# Altium schematic sheet Sheet1.SchDoc
size A4
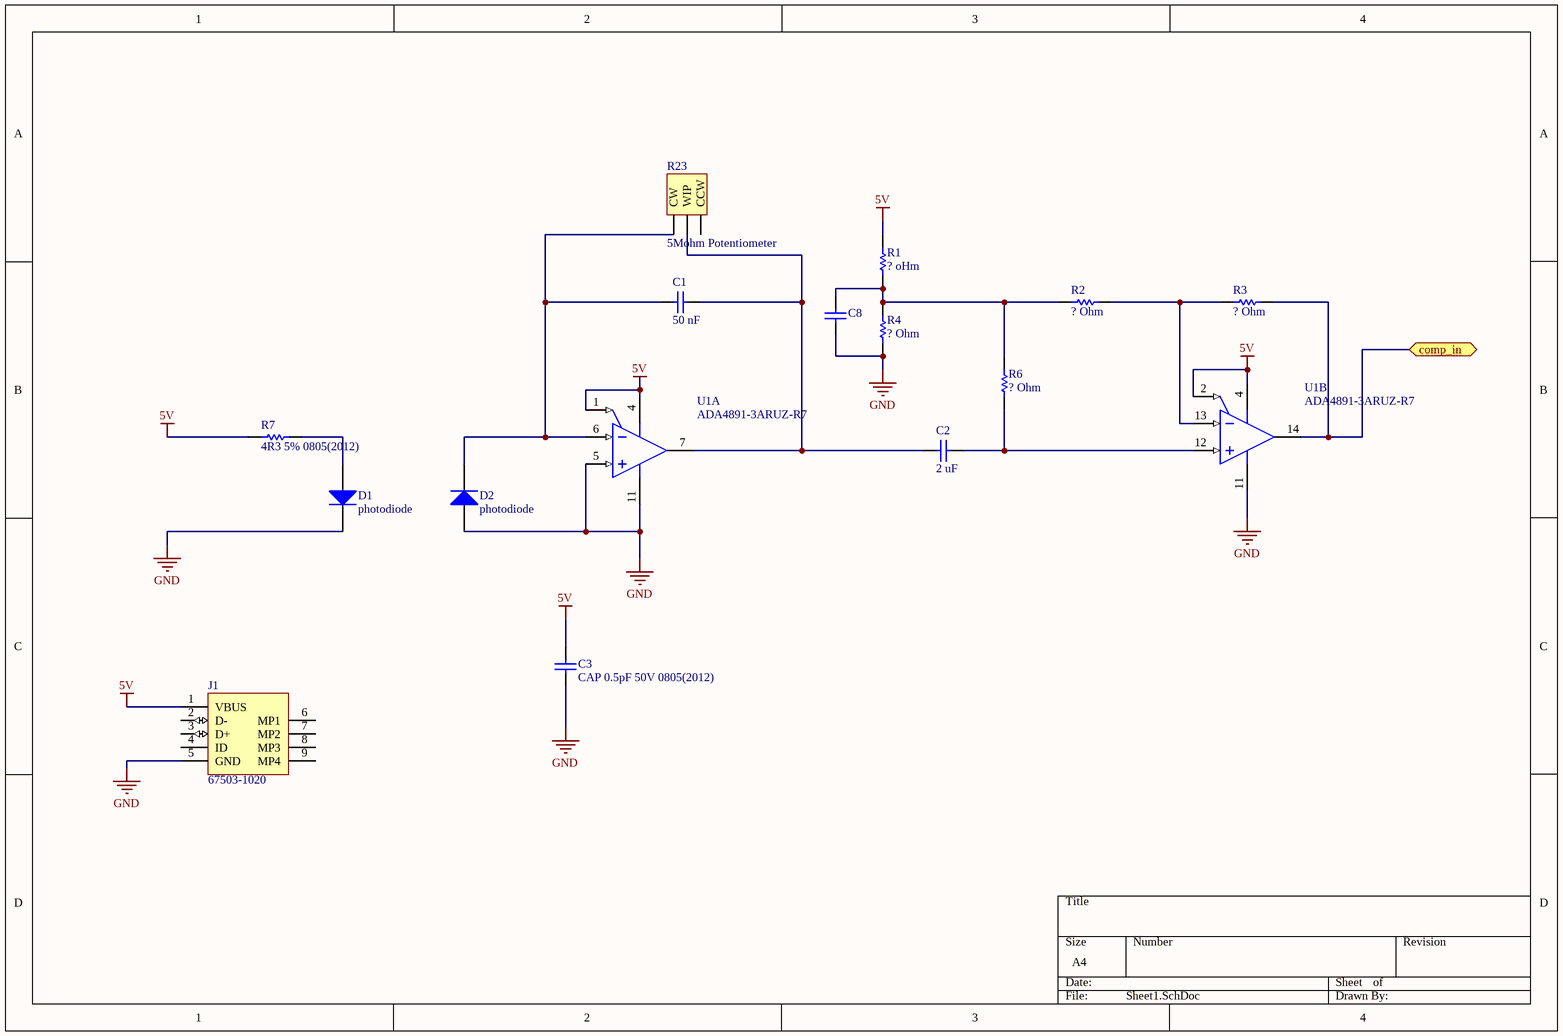
[diagram p0: Sheet1.SchDoc]

## Parts
C1  50 nF  [CAPC0805(2012)75_M]
C2  2 uF  [CAPC0805(2012)75_M]
C3  CAP 0.5pF 50V 0805(2012)  [CAPC0805(2012)75_M]
C8  CAP 0.5pF 50V 0805(2012)  [CAPC0805(2012)75_M]  (value not drawn)
D1  photodiode  [3mm_diode]
D2  photodiode  [3mm_diode]
J1  67503-1020  [MOLX-67503-1020_V]
R1  ? oHm  [RESC0805(2012)_M]
R2  ? Ohm  [RESC0805(2012)_M]
R3  ? Ohm  [RESC0805(2012)_M]
R4  ? Ohm  [RESC0805(2012)_M]
R6  ? Ohm  [RESC0805(2012)_M]
R7  4R3 5% 0805(2012)  [RESC0805(2012)_M]
R23  5Mohm Potentiometer  [5k_pot]
U1  ADA4891-3ARUZ-R7  [ADI-RU-14_L]  (parts A,B of 3)

## Ports
comp_in

## Nets
5V: C3.2 J1.1(VBUS) R1.2 R7.2 U1.1(~{PD1}) U1.2(~{PD2}) U1.4(+VS)
GND: C3.1 C8.1 D1.2(K) D2.1(A) J1.5(GND) R4.1 U1.5(+IN_1) U1.11(-VS)
comp_in: R3.2 U1.14(OUT_2) ; port comp_in
NetC1_1: C1.1 C2.2 R23.2(WIP) U1.7(OUT_1)
NetC1_2: C1.2 D2.2(K) R23.1(CW) U1.6(-IN_1)
NetC2_1: C2.1 R6.1 U1.12(+IN_2)
NetC8_2: C8.2 R1.1 R2.1 R4.2 R6.2
NetD1_1: D1.1(A) R7.1
NetR2_2: R2.2 R3.1 U1.13(-IN_2)

Not connected (* = marked no-connect by the designer): J1 2(D-) 3(D+) 4(ID) 6(MP1) 7(MP2) 8(MP3) 9(MP4); R23 3(CCW)

## Library data of the parts
C1-C3 C8 = CMP-1036-00018-1: CAP 0.5pF 50V ±0.1pF 0805 (2012 Metric) Thickness 0.75mm SMD; Case-EIA: 0805; Case-Metric: 2012; Tolerance: Â±0.1pF; Value: 0.5pF; Technology: SMT; Rated Voltage: 50 V; Max Thickness: 0.75 mm
J1 = CMP-0411-00002-1: USB, MINI, SMD, RA KME04-USBMU03A01; Manufacturer: Molex; ComponentLink1URL: http://www.molex.com/; PartNumber: 67503-1020; Mounting Technology: Surface Mount; ComponentLink1Description: Manufacturer URL; Terminal Pitch: 0.8 mm; DatasheetVersion: Rev F, 06/2009; ComponentLink2Description: Datasheet; PackageDescription: Mini USB Connector, SMT, Righer Angle; ComponentLink2URL: http://www.molex.com/pdm_docs/sd/675031020_sd.pdf; PackageReference: 67503-1020
R1-R4 R6 R7 = CMP-1013-00017-1: 4R3 0.125W 5% 0805 (2012 Metric)  SMD; Value: 4.30 Ohm; Case-Metric: 2012; Case-EIA: 0805; Tolerance: 5 %; Power: 0.125 W; Technology: SMT
R23 = 5Mohm Potentiometer: 3296W-1-505LF; Manufacturer PN: 3296W-1-505LF
U1 = CMP-0384-01869-1: 3 Channel Single-Supply Operation Operational Amplifier, 220 MHz BW, 170 V/us SR, Industrial, 14-pin SOP (RU-14), Reel; Manufacturer: Analog Devices; Small Signal Bandwidth: 220MHz; V Span Min: 2.7V; Iq/Amp: 4.4mA; Input Bias Current: 2pA; Amplifiers Per Package: 3; V Span Max: 5.5V; Input Offset Voltage: 2.5mV; ComponentLink2Description: Datasheet; DatasheetVersion: Rev. D; ComponentLink3Description: Package Specification; PartNumber: ADA4891-3ARUZ-R7; ComponentLink1URL: http://www.analog.com/en/index.html; ComponentLink2URL: http://www.analog.com/static/imported-files/data_sheets/ADA4891-1_4891-2_4891-3_4891-4.PDF; ComponentLink3URL: http://www.analog.com/static/imported-files/packages/36057385283879153717235186773RU14.pdf; Packing: Reel; ComponentLink1Description: Manufacturer URL; PackageDescription: 14-Pin Thin Shrink Small Outline Package, Body 5 x 4.4 mm, Pitch 0.65 mm; Generic Part Number: ADA4891-3; Mounting Technology: Surface Mount; PackageReference: RU-14; Code_JEDEC: MO-153AB-1; Slew Rate: 170V/us; PartId: 1
D1 D2 = photodiode: partnumber: *